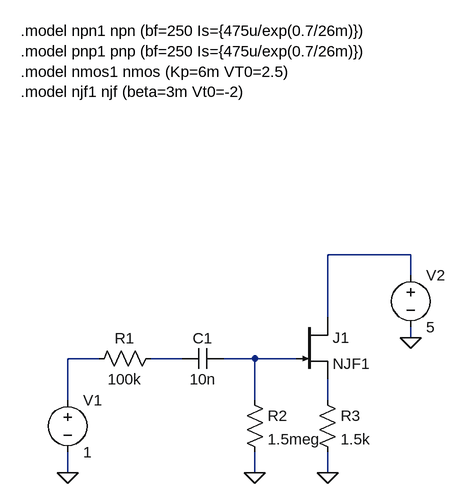
[diagram p0: schematic ss06.asc]
ss06.asc, the LTspice schematic file:
Version 4
SHEET 1 880 916
WIRE 672 560 544 560
WIRE 672 592 672 560
WIRE 544 656 544 560
WIRE 672 688 672 672
WIRE 192 720 144 720
WIRE 320 720 272 720
WIRE 432 720 384 720
WIRE 496 720 432 720
WIRE 144 784 144 720
WIRE 432 784 432 720
WIRE 544 784 544 752
WIRE 144 896 144 864
WIRE 432 896 432 864
WIRE 544 896 544 864
FLAG 672 688 0
FLAG 544 896 0
FLAG 432 896 0
FLAG 144 896 0
SYMBOL voltage 144 768 R0
SYMATTR InstName V1
SYMATTR Value 1
SYMBOL voltage 672 576 R0
SYMATTR InstName V2
SYMATTR Value 5
SYMBOL res 288 704 R90
WINDOW 0 0 56 VBottom 2
WINDOW 3 32 56 VTop 2
SYMATTR InstName R1
SYMATTR Value 100k
SYMBOL cap 384 704 R90
WINDOW 0 0 32 VBottom 2
WINDOW 3 32 32 VTop 2
SYMATTR InstName C1
SYMATTR Value 10n
SYMBOL res 416 768 R0
SYMATTR InstName R2
SYMATTR Value 1.5meg
SYMBOL res 528 768 R0
SYMATTR InstName R3
SYMATTR Value 1.5k
SYMBOL njf 496 656 R0
SYMATTR InstName J1
SYMATTR Value NJF1
TEXT 72 216 Left 2 !.model npn1 npn (bf=250 Is={475u/exp(0.7/26m)})\n.model pnp1 pnp (bf=250 Is={475u/exp(0.7/26m)})\n.model nmos1 nmos (Kp=6m VT0=2.5)\n.model njf1 njf (beta=3m Vt0=-2)

The netlist it stands for:
* ss06.asc
V1 N002 0 1
V2 N001 0 5
R1 N003 N002 100k
C1 N004 N003 10n
R2 N004 0 1.5meg
R3 N005 0 1.5k
J1 N001 N004 N005 NJF1
.model NJF NJF
.model PJF PJF
.lib standard.jft
.model npn1 npn (bf=250 Is={475u/exp(0.7/26m)})
.model pnp1 pnp (bf=250 Is={475u/exp(0.7/26m)})
.model nmos1 nmos (Kp=6m VT0=2.5)
.model njf1 njf (beta=3m Vt0=-2)
.backanno
.end